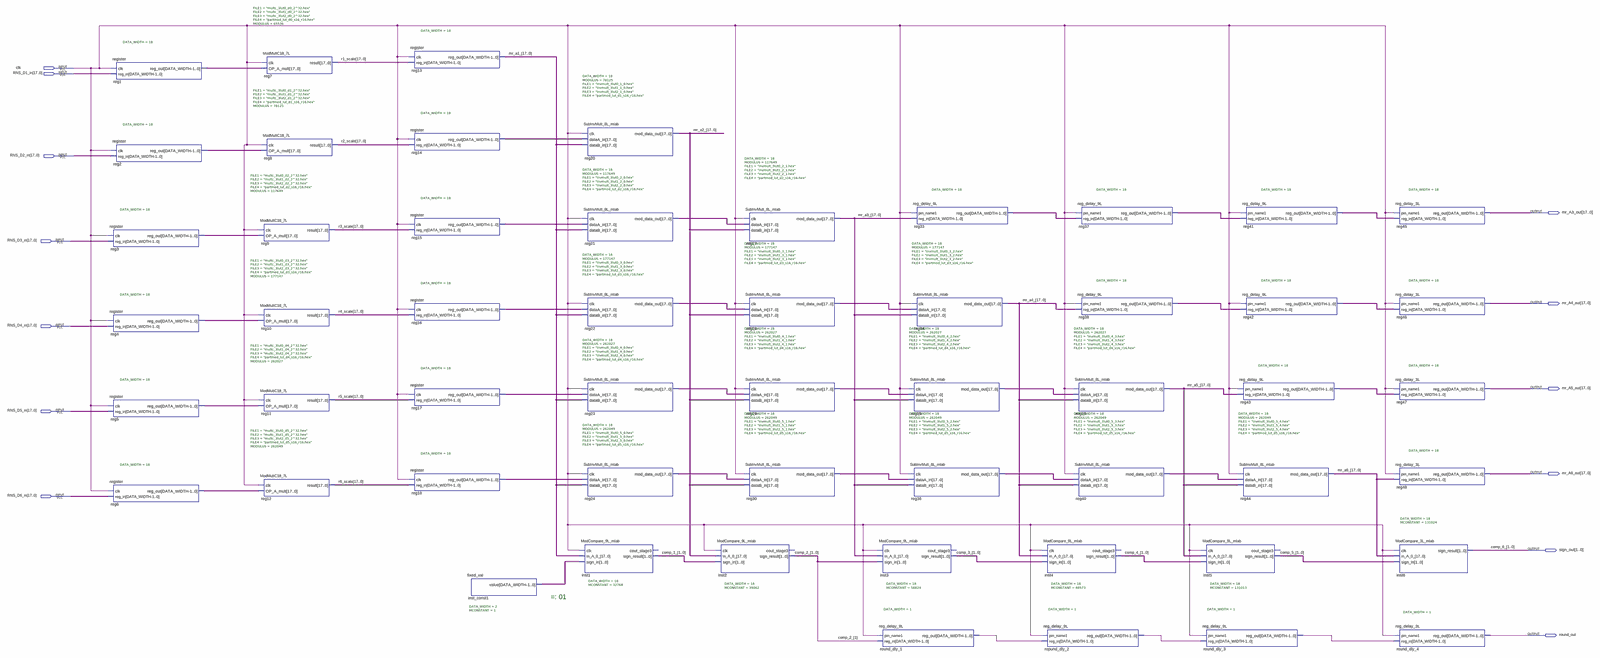
[diagram p0: schematic sheet, whole]
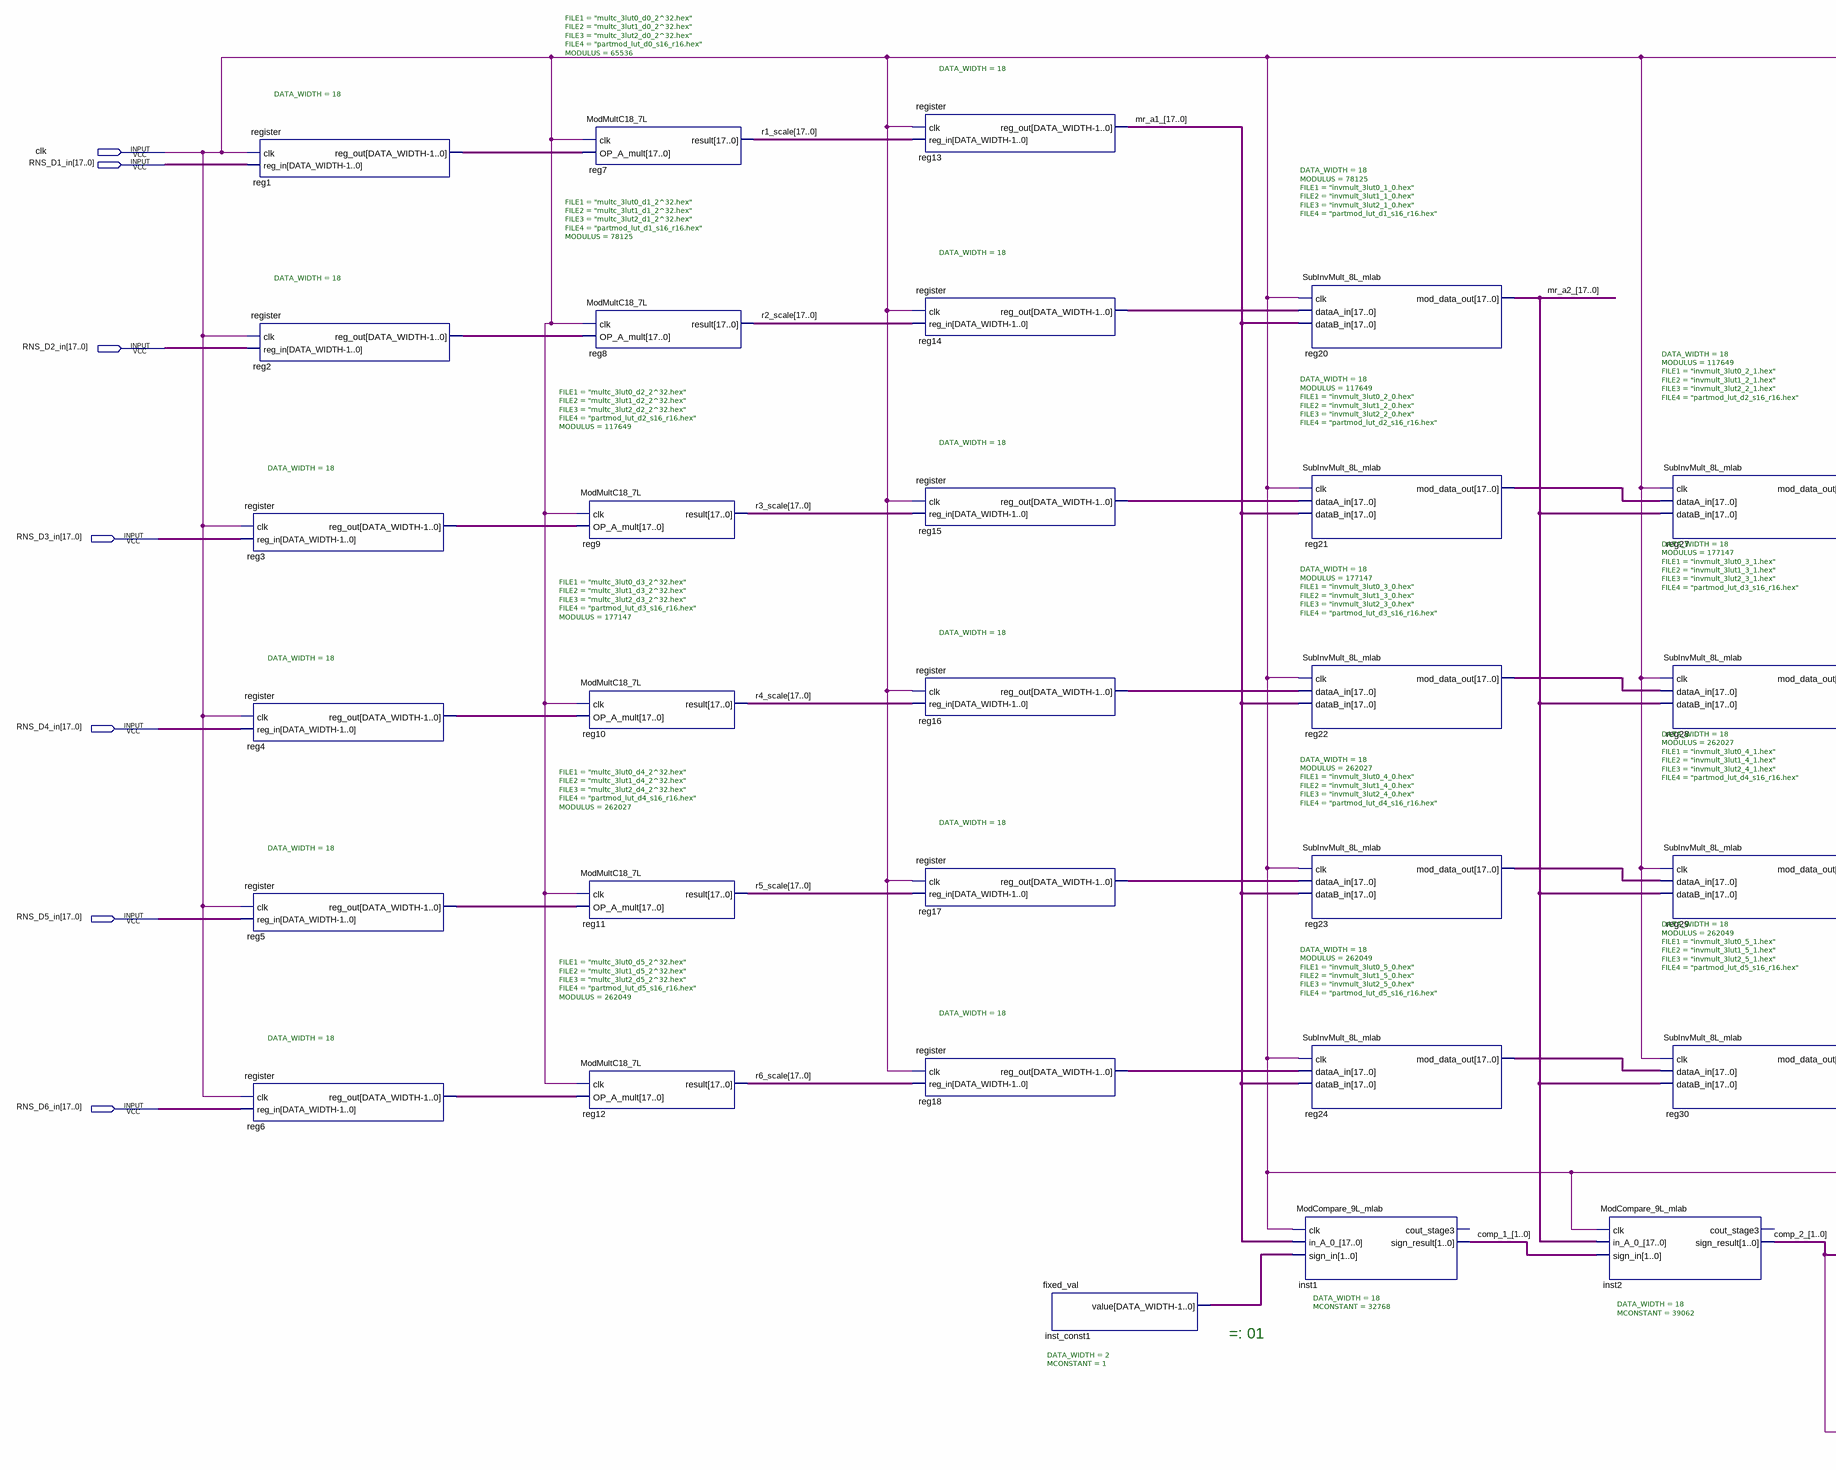
[diagram p1: schematic sheet, left part]
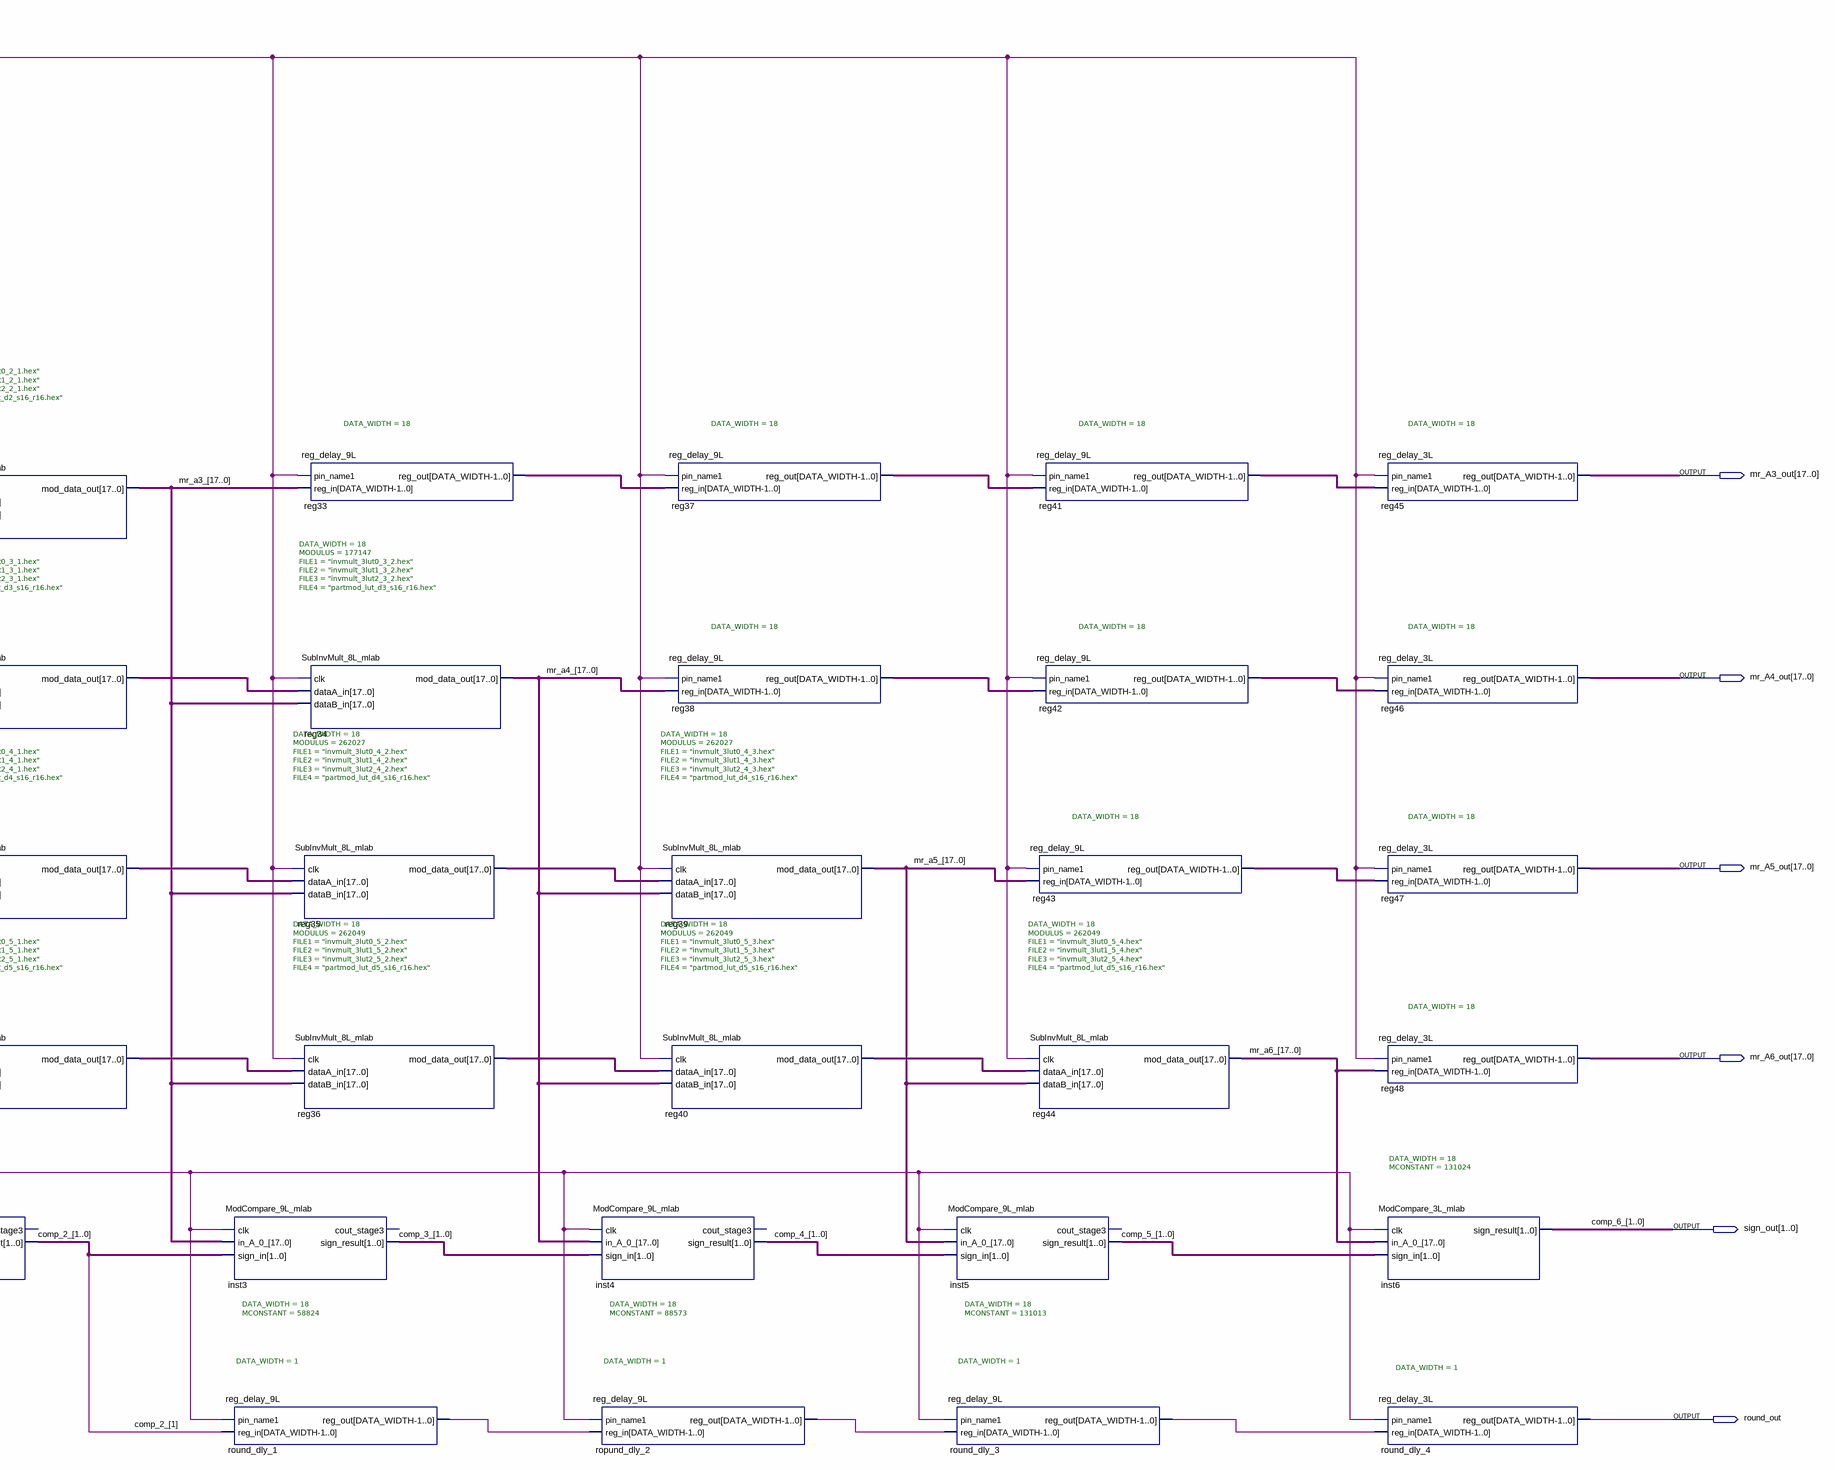
[diagram p2: schematic sheet, right part]
// Quartus schematic RFracConv18_16_stg1.bdf as structural Verilog: 54 symbols, 13 pins
module RFracConv18_16_stg1 (
  input  clk,
  input  [17:0] RNS_D1_in,
  input  [17:0] RNS_D2_in,
  input  [17:0] RNS_D3_in,
  input  [17:0] RNS_D4_in,
  input  [17:0] RNS_D5_in,
  input  [17:0] RNS_D6_in,
  output [17:0] mr_A3_out,
  output [17:0] mr_A4_out,
  output [17:0] mr_A5_out,
  output [17:0] mr_A6_out,
  output [1:0] sign_out,
  output round_out
);

  wire ropund_dly_2_reg_out, round_dly_1_reg_out, round_dly_3_reg_out;
  wire [1:0] comp_1_, comp_2_, comp_3_, comp_4_, comp_5_, inst_const1_value;
  wire [17:0] mr_a1_, mr_a2_, mr_a3_, mr_a4_, mr_a5_, mr_a6_, r1_scale, r2_scale, r3_scale, r4_scale,
       r5_scale, r6_scale, reg1_reg_out, reg2_reg_out, reg3_reg_out, reg4_reg_out, reg5_reg_out,
       reg6_reg_out, reg14_reg_out, reg15_reg_out, reg16_reg_out, reg17_reg_out, reg18_reg_out,
       reg21_mod_data_out, reg22_mod_data_out, reg23_mod_data_out, reg24_mod_data_out, reg28_mod_data_out,
       reg29_mod_data_out, reg30_mod_data_out, reg33_reg_out, reg35_mod_data_out, reg36_mod_data_out,
       reg37_reg_out, reg38_reg_out, reg40_mod_data_out, reg41_reg_out, reg42_reg_out, reg43_reg_out;

  register #(.DATA_WIDTH(18)) reg1 (.clk(clk), .reg_in(RNS_D1_in), .reg_out(reg1_reg_out));
  register #(.DATA_WIDTH(18)) reg2 (.clk(clk), .reg_in(RNS_D2_in), .reg_out(reg2_reg_out));
  register #(.DATA_WIDTH(18)) reg3 (.clk(clk), .reg_in(RNS_D3_in), .reg_out(reg3_reg_out));
  register #(.DATA_WIDTH(18)) reg4 (.clk(clk), .reg_in(RNS_D4_in), .reg_out(reg4_reg_out));
  register #(.DATA_WIDTH(18)) reg5 (.clk(clk), .reg_in(RNS_D5_in), .reg_out(reg5_reg_out));
  register #(.DATA_WIDTH(18)) reg6 (.clk(clk), .reg_in(RNS_D6_in), .reg_out(reg6_reg_out));
  ModMultC18_7L #(.FILE1("multc_3lut0_d0_2^32.hex"), .FILE2("multc_3lut1_d0_2^32.hex"), .FILE3("multc_3lut2_d0_2^32.hex"), .FILE4("partmod_lut_d0_s16_r16.hex"), .MODULUS(65536)) reg7 (
    .clk(clk), .OP_A_mult(reg1_reg_out), .result(r1_scale));
  ModMultC18_7L #(.FILE1("multc_3lut0_d1_2^32.hex"), .FILE2("multc_3lut1_d1_2^32.hex"), .FILE3("multc_3lut2_d1_2^32.hex"), .FILE4("partmod_lut_d1_s16_r16.hex"), .MODULUS(78125)) reg8 (
    .clk(clk), .OP_A_mult(reg2_reg_out), .result(r2_scale));
  ModMultC18_7L #(.FILE1("multc_3lut0_d2_2^32.hex"), .FILE2("multc_3lut1_d2_2^32.hex"), .FILE3("multc_3lut2_d2_2^32.hex"), .FILE4("partmod_lut_d2_s16_r16.hex"), .MODULUS(117649)) reg9 (
    .clk(clk), .OP_A_mult(reg3_reg_out), .result(r3_scale));
  ModMultC18_7L #(.FILE1("multc_3lut0_d3_2^32.hex"), .FILE2("multc_3lut1_d3_2^32.hex"), .FILE3("multc_3lut2_d3_2^32.hex"), .FILE4("partmod_lut_d3_s16_r16.hex"), .MODULUS(177147)) reg10 (
    .clk(clk), .OP_A_mult(reg4_reg_out), .result(r4_scale));
  ModMultC18_7L #(.FILE1("multc_3lut0_d4_2^32.hex"), .FILE2("multc_3lut1_d4_2^32.hex"), .FILE3("multc_3lut2_d4_2^32.hex"), .FILE4("partmod_lut_d4_s16_r16.hex"), .MODULUS(262027)) reg11 (
    .clk(clk), .OP_A_mult(reg5_reg_out), .result(r5_scale));
  ModMultC18_7L #(.FILE1("multc_3lut0_d5_2^32.hex"), .FILE2("multc_3lut1_d5_2^32.hex"), .FILE3("multc_3lut2_d5_2^32.hex"), .FILE4("partmod_lut_d5_s16_r16.hex"), .MODULUS(262049)) reg12 (
    .clk(clk), .OP_A_mult(reg6_reg_out), .result(r6_scale));
  register #(.DATA_WIDTH(18)) reg13 (.clk(clk), .reg_in(r1_scale), .reg_out(mr_a1_));
  register #(.DATA_WIDTH(18)) reg14 (.clk(clk), .reg_in(r2_scale), .reg_out(reg14_reg_out));
  register #(.DATA_WIDTH(18)) reg15 (.clk(clk), .reg_in(r3_scale), .reg_out(reg15_reg_out));
  register #(.DATA_WIDTH(18)) reg16 (.clk(clk), .reg_in(r4_scale), .reg_out(reg16_reg_out));
  register #(.DATA_WIDTH(18)) reg17 (.clk(clk), .reg_in(r5_scale), .reg_out(reg17_reg_out));
  register #(.DATA_WIDTH(18)) reg18 (.clk(clk), .reg_in(r6_scale), .reg_out(reg18_reg_out));
  fixed_val #(.DATA_WIDTH(2), .MCONSTANT(1)) inst_const1 (.value(inst_const1_value));
  SubInvMult_8L_mlab #(.DATA_WIDTH(18), .MODULUS(78125), .FILE1("invmult_3lut0_1_0.hex"), .FILE2("invmult_3lut1_1_0.hex"), .FILE3("invmult_3lut2_1_0.hex"), .FILE4("partmod_lut_d1_s16_r16.hex")) reg20 (
    .clk(clk), .dataA_in(reg14_reg_out), .dataB_in(mr_a1_), .mod_data_out(mr_a2_));
  SubInvMult_8L_mlab #(.DATA_WIDTH(18), .MODULUS(117649), .FILE1("invmult_3lut0_2_0.hex"), .FILE2("invmult_3lut1_2_0.hex"), .FILE3("invmult_3lut2_2_0.hex"), .FILE4("partmod_lut_d2_s16_r16.hex")) reg21 (
    .clk(clk), .dataA_in(reg15_reg_out), .dataB_in(mr_a1_), .mod_data_out(reg21_mod_data_out));
  SubInvMult_8L_mlab #(.DATA_WIDTH(18), .MODULUS(177147), .FILE1("invmult_3lut0_3_0.hex"), .FILE2("invmult_3lut1_3_0.hex"), .FILE3("invmult_3lut2_3_0.hex"), .FILE4("partmod_lut_d3_s16_r16.hex")) reg22 (
    .clk(clk), .dataA_in(reg16_reg_out), .dataB_in(mr_a1_), .mod_data_out(reg22_mod_data_out));
  SubInvMult_8L_mlab #(.DATA_WIDTH(18), .MODULUS(262027), .FILE1("invmult_3lut0_4_0.hex"), .FILE2("invmult_3lut1_4_0.hex"), .FILE3("invmult_3lut2_4_0.hex"), .FILE4("partmod_lut_d4_s16_r16.hex")) reg23 (
    .clk(clk), .dataA_in(reg17_reg_out), .dataB_in(mr_a1_), .mod_data_out(reg23_mod_data_out));
  SubInvMult_8L_mlab #(.DATA_WIDTH(18), .MODULUS(262049), .FILE1("invmult_3lut0_5_0.hex"), .FILE2("invmult_3lut1_5_0.hex"), .FILE3("invmult_3lut2_5_0.hex"), .FILE4("partmod_lut_d5_s16_r16.hex")) reg24 (
    .clk(clk), .dataA_in(reg18_reg_out), .dataB_in(mr_a1_), .mod_data_out(reg24_mod_data_out));
  ModCompare_9L_mlab #(.DATA_WIDTH(18), .MCONSTANT(32768)) inst1 (
    .clk(clk), .in_A_0_(mr_a1_), .sign_in(inst_const1_value), .sign_result(comp_1_));  // open: cout_stage3
  ModCompare_9L_mlab #(.DATA_WIDTH(18), .MCONSTANT(39062)) inst2 (
    .clk(clk), .in_A_0_(mr_a2_), .sign_in(comp_1_), .sign_result(comp_2_));  // open: cout_stage3
  SubInvMult_8L_mlab #(.DATA_WIDTH(18), .MODULUS(117649), .FILE1("invmult_3lut0_2_1.hex"), .FILE2("invmult_3lut1_2_1.hex"), .FILE3("invmult_3lut2_2_1.hex"), .FILE4("partmod_lut_d2_s16_r16.hex")) reg27 (
    .clk(clk), .dataA_in(reg21_mod_data_out), .dataB_in(mr_a2_), .mod_data_out(mr_a3_));
  SubInvMult_8L_mlab #(.DATA_WIDTH(18), .MODULUS(177147), .FILE1("invmult_3lut0_3_1.hex"), .FILE2("invmult_3lut1_3_1.hex"), .FILE3("invmult_3lut2_3_1.hex"), .FILE4("partmod_lut_d3_s16_r16.hex")) reg28 (
    .clk(clk), .dataA_in(reg22_mod_data_out), .dataB_in(mr_a2_), .mod_data_out(reg28_mod_data_out));
  SubInvMult_8L_mlab #(.DATA_WIDTH(18), .MODULUS(262027), .FILE1("invmult_3lut0_4_1.hex"), .FILE2("invmult_3lut1_4_1.hex"), .FILE3("invmult_3lut2_4_1.hex"), .FILE4("partmod_lut_d4_s16_r16.hex")) reg29 (
    .clk(clk), .dataA_in(reg23_mod_data_out), .dataB_in(mr_a2_), .mod_data_out(reg29_mod_data_out));
  SubInvMult_8L_mlab #(.DATA_WIDTH(18), .MODULUS(262049), .FILE1("invmult_3lut0_5_1.hex"), .FILE2("invmult_3lut1_5_1.hex"), .FILE3("invmult_3lut2_5_1.hex"), .FILE4("partmod_lut_d5_s16_r16.hex")) reg30 (
    .clk(clk), .dataA_in(reg24_mod_data_out), .dataB_in(mr_a2_), .mod_data_out(reg30_mod_data_out));
  ModCompare_9L_mlab #(.DATA_WIDTH(18), .MCONSTANT(58824)) inst3 (
    .clk(clk), .in_A_0_(mr_a3_), .sign_in(comp_2_), .sign_result(comp_3_));  // open: cout_stage3
  reg_delay_9L #(.DATA_WIDTH(1)) round_dly_1 (.pin_name1(clk), .reg_in(comp_2_[1]), .reg_out(round_dly_1_reg_out));
  reg_delay_9L #(.DATA_WIDTH(18)) reg33 (.pin_name1(clk), .reg_in(mr_a3_), .reg_out(reg33_reg_out));
  SubInvMult_8L_mlab #(.DATA_WIDTH(18), .MODULUS(177147), .FILE1("invmult_3lut0_3_2.hex"), .FILE2("invmult_3lut1_3_2.hex"), .FILE3("invmult_3lut2_3_2.hex"), .FILE4("partmod_lut_d3_s16_r16.hex")) reg34 (
    .clk(clk), .dataA_in(reg28_mod_data_out), .dataB_in(mr_a3_), .mod_data_out(mr_a4_));
  SubInvMult_8L_mlab #(.DATA_WIDTH(18), .MODULUS(262027), .FILE1("invmult_3lut0_4_2.hex"), .FILE2("invmult_3lut1_4_2.hex"), .FILE3("invmult_3lut2_4_2.hex"), .FILE4("partmod_lut_d4_s16_r16.hex")) reg35 (
    .clk(clk), .dataA_in(reg29_mod_data_out), .dataB_in(mr_a3_), .mod_data_out(reg35_mod_data_out));
  SubInvMult_8L_mlab #(.DATA_WIDTH(18), .MODULUS(262049), .FILE1("invmult_3lut0_5_2.hex"), .FILE2("invmult_3lut1_5_2.hex"), .FILE3("invmult_3lut2_5_2.hex"), .FILE4("partmod_lut_d5_s16_r16.hex")) reg36 (
    .clk(clk), .dataA_in(reg30_mod_data_out), .dataB_in(mr_a3_), .mod_data_out(reg36_mod_data_out));
  ModCompare_9L_mlab #(.DATA_WIDTH(18), .MCONSTANT(88573)) inst4 (
    .clk(clk), .in_A_0_(mr_a4_), .sign_in(comp_3_), .sign_result(comp_4_));  // open: cout_stage3
  reg_delay_9L #(.DATA_WIDTH(1)) ropund_dly_2 (
    .pin_name1(clk), .reg_in(round_dly_1_reg_out), .reg_out(ropund_dly_2_reg_out));
  reg_delay_9L #(.DATA_WIDTH(18)) reg37 (.pin_name1(clk), .reg_in(reg33_reg_out), .reg_out(reg37_reg_out));
  reg_delay_9L #(.DATA_WIDTH(18)) reg38 (.pin_name1(clk), .reg_in(mr_a4_), .reg_out(reg38_reg_out));
  SubInvMult_8L_mlab #(.DATA_WIDTH(18), .MODULUS(262027), .FILE1("invmult_3lut0_4_3.hex"), .FILE2("invmult_3lut1_4_3.hex"), .FILE3("invmult_3lut2_4_3.hex"), .FILE4("partmod_lut_d4_s16_r16.hex")) reg39 (
    .clk(clk), .dataA_in(reg35_mod_data_out), .dataB_in(mr_a4_), .mod_data_out(mr_a5_));
  SubInvMult_8L_mlab #(.DATA_WIDTH(18), .MODULUS(262049), .FILE1("invmult_3lut0_5_3.hex"), .FILE2("invmult_3lut1_5_3.hex"), .FILE3("invmult_3lut2_5_3.hex"), .FILE4("partmod_lut_d5_s16_r16.hex")) reg40 (
    .clk(clk), .dataA_in(reg36_mod_data_out), .dataB_in(mr_a4_), .mod_data_out(reg40_mod_data_out));
  ModCompare_9L_mlab #(.DATA_WIDTH(18), .MCONSTANT(131013)) inst5 (
    .clk(clk), .in_A_0_(mr_a5_), .sign_in(comp_4_), .sign_result(comp_5_));  // open: cout_stage3
  reg_delay_9L #(.DATA_WIDTH(1)) round_dly_3 (
    .pin_name1(clk), .reg_in(ropund_dly_2_reg_out), .reg_out(round_dly_3_reg_out));
  reg_delay_9L #(.DATA_WIDTH(18)) reg41 (.pin_name1(clk), .reg_in(reg37_reg_out), .reg_out(reg41_reg_out));
  reg_delay_9L #(.DATA_WIDTH(18)) reg42 (.pin_name1(clk), .reg_in(reg38_reg_out), .reg_out(reg42_reg_out));
  reg_delay_9L #(.DATA_WIDTH(18)) reg43 (.pin_name1(clk), .reg_in(mr_a5_), .reg_out(reg43_reg_out));
  SubInvMult_8L_mlab #(.DATA_WIDTH(18), .MODULUS(262049), .FILE1("invmult_3lut0_5_4.hex"), .FILE2("invmult_3lut1_5_4.hex"), .FILE3("invmult_3lut2_5_4.hex"), .FILE4("partmod_lut_d5_s16_r16.hex")) reg44 (
    .clk(clk), .dataA_in(reg40_mod_data_out), .dataB_in(mr_a5_), .mod_data_out(mr_a6_));
  reg_delay_3L #(.DATA_WIDTH(18)) reg45 (.pin_name1(clk), .reg_in(reg41_reg_out), .reg_out(mr_A3_out));
  reg_delay_3L #(.DATA_WIDTH(18)) reg46 (.pin_name1(clk), .reg_in(reg42_reg_out), .reg_out(mr_A4_out));
  reg_delay_3L #(.DATA_WIDTH(18)) reg47 (.pin_name1(clk), .reg_in(reg43_reg_out), .reg_out(mr_A5_out));
  reg_delay_3L #(.DATA_WIDTH(18)) reg48 (.pin_name1(clk), .reg_in(mr_a6_), .reg_out(mr_A6_out));
  ModCompare_3L_mlab #(.DATA_WIDTH(18), .MCONSTANT(131024)) inst6 (
    .clk(clk), .in_A_0_(mr_a6_), .sign_in(comp_5_), .sign_result(sign_out));
  reg_delay_3L #(.DATA_WIDTH(1)) round_dly_4 (.pin_name1(clk), .reg_in(round_dly_3_reg_out), .reg_out(round_out));

  // Other names for the same wires on the sheet: comp_6_[1:0] = sign_out

  // Notes on the sheet:
  //   =: 01
endmodule
